# EAGLE design Modulator and Front End (EAGLE 5.11)

## Sheet 1 of 3
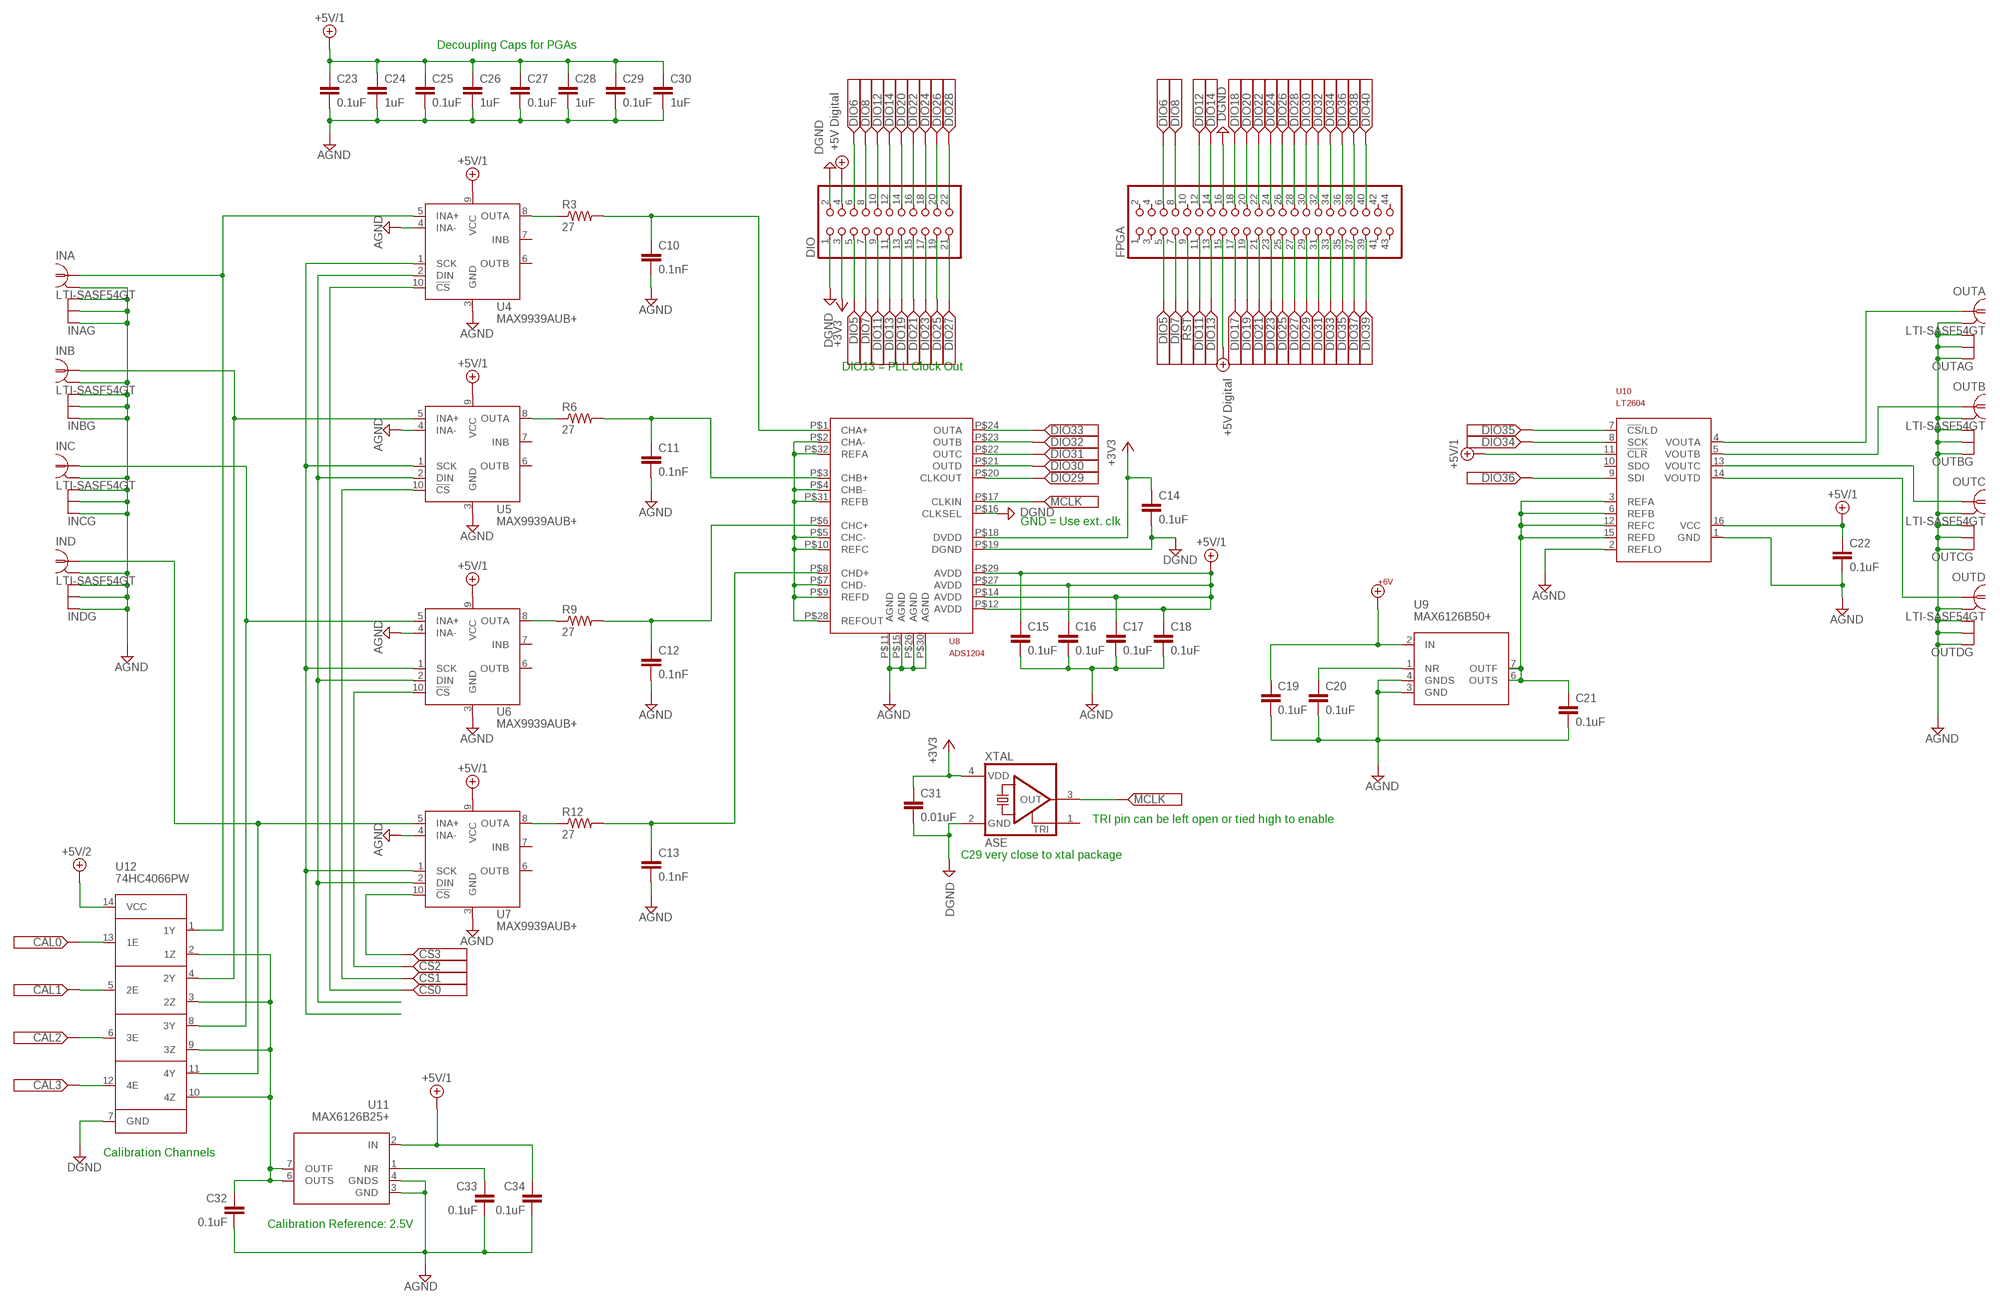
[diagram p0: schematic, sheet 1]

### Parts
C10  0.1nF  C-EUC0805  [C0805]
C11  0.1nF  C-EUC0805  [C0805]
C12  0.1nF  C-EUC0805  [C0805]
C13  0.1nF  C-EUC0805  [C0805]
C14  0.1uF  C-EUC0805  [C0805]
C15  0.1uF  C-EUC0805  [C0805]
C16  0.1uF  C-EUC0805  [C0805]
C17  0.1uF  C-EUC0805  [C0805]
C18  0.1uF  C-EUC0805  [C0805]
C19  0.1uF  C-EUC0805  [C0805]
C20  0.1uF  C-EUC0805  [C0805]
C21  0.1uF  C-EUC0805  [C0805]
C22  0.1uF  C-EUC0805  [C0805]
C23  0.1uF  C-EUC0805  [C0805]
C24  1uF  C-EUC0805  [C0805]
C25  0.1uF  C-EUC0805  [C0805]
C26  1uF  C-EUC0805  [C0805]
C27  0.1uF  C-EUC0805  [C0805]
C28  1uF  C-EUC0805  [C0805]
C29  0.1uF  C-EUC0805  [C0805]
C30  1uF  C-EUC0805  [C0805]
C31  0.01uF  C-EUC0805  [C0805]
C32  0.1uF  C-EUC0805  [C0805]
C33  0.1uF  C-EUC0805  [C0805]
C34  0.1uF  C-EUC0805  [C0805]
DIO  PINHD-2X11  [2X11]
FPGA  PINHD-2X22  [2X22]
INA  LTI-SASF54GT  [LTI-SASF54GT]
INB  LTI-SASF54GT  [LTI-SASF54GT]
INC  LTI-SASF54GT  [LTI-SASF54GT]
IND  LTI-SASF54GT  [LTI-SASF54GT]
OUTA  LTI-SASF54GT  [LTI-SASF54GT]
OUTB  LTI-SASF54GT  [LTI-SASF54GT]
OUTC  LTI-SASF54GT  [LTI-SASF54GT]
OUTD  LTI-SASF54GT  [LTI-SASF54GT]
R3  27  R-US_M0805  [M0805]
R6  27  R-US_M0805  [M0805]
R9  27  R-US_M0805  [M0805]
R12  27  R-US_M0805  [M0805]
U4  MAX9939AUB+  [UMAX10]
U5  MAX9939AUB+  [UMAX10]
U6  MAX9939AUB+  [UMAX10]
U7  MAX9939AUB+  [UMAX10]
U8  ADS1204  [QFN-32]
U9  MAX6126B50+  [UMAX8]
U10  LT2604  [SSOP16]
U11  MAX6126B25+  [UMAX8]
U12  74HC4066PW  [TSSOP14]
XTAL  ASE  [ASE]

### Nets
+3V3: C14.1 C31.1 DIO.3 U8.P$18(DVDD) XTAL.4(VDD) ; also sheet 2
+5V/1: C15.1 C16.1 C17.1 C18.1 C22.1 C23.1 C24.1 C25.1 C26.1 C27.1 C28.1 C29.1 C30.1 C34.1 U4.9(VCC) U5.9(VCC) U6.9(VCC) U7.9(VCC) U8.P$12(AVDD) U8.P$14(AVDD) U8.P$27(AVDD) U8.P$29(AVDD) U10.11(!CLR) U10.16(VCC) U11.2(IN) ; also sheet 2
+5V/2: DIO.4 FPGA.15 U12.14(VCC) ; supply symbol labelled +5V Digital ; also sheet 2,3
+6V: C19.1 U9.2(IN) ; also sheet 2
AGND: C10.2 C11.2 C12.2 C13.2 C15.2 C16.2 C17.2 C18.2 C19.2 C20.2 C21.2 C22.2 C23.2 C24.2 C25.2 C26.2 C27.2 C28.2 C29.2 C30.2 C32.2 C33.2 C34.2 INA.2(GND) INA.3(GND) INA.4(GND) INA.5(GND) INB.2(GND) INB.3(GND) INB.4(GND) INB.5(GND) INC.2(GND) INC.3(GND) INC.4(GND) INC.5(GND) IND.2(GND) IND.3(GND) IND.4(GND) IND.5(GND) OUTA.2(GND) OUTA.3(GND) OUTA.4(GND) OUTA.5(GND) OUTB.2(GND) OUTB.3(GND) OUTB.4(GND) OUTB.5(GND) OUTC.2(GND) OUTC.3(GND) OUTC.4(GND) OUTC.5(GND) OUTD.2(GND) OUTD.3(GND) OUTD.4(GND) OUTD.5(GND) U4.3(GND) U4.4(INA-) U5.3(GND) U5.4(INA-) U6.3(GND) U6.4(INA-) U7.3(GND) U7.4(INA-) U8.P$11(AGND) U8.P$15(AGND) U8.P$26(AGND) U8.P$30(AGND) U9.3(GND) U9.4(GNDS) U10.1(GND) U10.2(REFLO) U11.3(GND) U11.4(GNDS) ; also sheet 2
CAL0: U12.13(1E) ; also sheet 3
CAL1: U12.5(2E) ; also sheet 3
CAL2: U12.6(3E) ; also sheet 3
CAL3: U12.12(4E) ; also sheet 3
CS0: U4.10(!CS) ; also sheet 3
CS1: U5.10(!CS) ; also sheet 3
CS2: U6.10(!CS) ; also sheet 3
CS3: U7.10(!CS) ; also sheet 3
DGND: C14.2 C31.2 DIO.1 DIO.2 FPGA.16 U8.P$16(CLKSEL) U8.P$19(DGND) U12.7(GND) XTAL.2(GND) ; also sheet 2,3
DIO5: DIO.5 FPGA.5
DIO6: DIO.6 FPGA.6
DIO7: DIO.7 FPGA.7
DIO8: DIO.8 FPGA.8
DIO11: DIO.9 FPGA.11
DIO12: DIO.10 FPGA.12
DIO13: DIO.11 FPGA.13
DIO14: DIO.12 FPGA.14
DIO17: FPGA.17
DIO18: FPGA.18
DIO19: DIO.13 FPGA.19
DIO20: DIO.14 FPGA.20
DIO21: DIO.15 FPGA.21
DIO22: DIO.16 FPGA.22
DIO23: DIO.17 FPGA.23
DIO24: DIO.18 FPGA.24
DIO25: DIO.19 FPGA.25
DIO26: DIO.20 FPGA.26
DIO27: DIO.21 FPGA.27
DIO28: DIO.22 FPGA.28
DIO29: FPGA.29 U8.P$20(CLKOUT)
DIO30: FPGA.30 U8.P$21(OUTD)
DIO31: FPGA.31 U8.P$22(OUTC)
DIO32: FPGA.32 U8.P$23(OUTB)
DIO33: FPGA.33 U8.P$24(OUTA)
DIO34: FPGA.34 U10.8(SCK) ; also sheet 3
DIO35: FPGA.35 U10.7(!CS!/LD)
DIO36: FPGA.36 U10.9(SDI) ; also sheet 3
DIO37: FPGA.37
DIO38: FPGA.38
DIO39: FPGA.39
DIO40: FPGA.40
MCLK: U8.P$17(CLKIN) XTAL.3(OUT)
N$1: R12.1 U7.8(OUTA)
N$3: R9.1 U6.8(OUTA)
N$4: C10.1 R3.2 U8.P$1(CHA+)
N$6: R6.1 U5.8(OUTA)
N$10: R3.1 U4.8(OUTA)
N$11: C32.1 U11.6(OUTS) U11.7(OUTF) U12.2(1Z) U12.3(2Z) U12.9(3Z) U12.10(4Z)
N$12: C33.1 U11.1(NR)
N$14: C11.1 R6.2 U8.P$3(CHB+)
N$15: INA.1 U4.5(INA+) U12.1(1Y)
N$17: INB.1 U5.5(INA+) U12.4(2Y)
N$18: INC.1 U6.5(INA+) U12.8(3Y)
N$20: C12.1 R9.2 U8.P$6(CHC+)
N$21: C13.1 R12.2 U8.P$8(CHD+)
N$25: IND.1 U7.5(INA+) U12.11(4Y)
N$26: C20.1 U9.1(NR)
N$30: C21.1 U9.6(OUTS) U9.7(OUTF) U10.3(REFA) U10.6(REFB) U10.12(REFC) U10.15(REFD)
N$32: OUTA.1 U10.4(VOUTA)
N$33: OUTB.1 U10.5(VOUTB)
N$34: OUTC.1 U10.13(VOUTC)
N$35: OUTD.1 U10.14(VOUTD)
PDAT: U4.2(DIN) U5.2(DIN) U6.2(DIN) U7.2(DIN)
PLAT: U4.1(SCK) U5.1(SCK) U6.1(SCK) U7.1(SCK)
RST: FPGA.9
VREF: U8.P$2(CHA-) U8.P$4(CHB-) U8.P$5(CHC-) U8.P$7(CHD-) U8.P$9(REFD) U8.P$10(REFC) U8.P$28(REFOUT) U8.P$31(REFB) U8.P$32(REFA)
Unconnected: FPGA.1 FPGA.2 FPGA.3 FPGA.4 FPGA.10 FPGA.41 FPGA.42 FPGA.43 FPGA.44 U4.6(OUTB) U4.7(INB) U5.6(OUTB) U5.7(INB) U6.6(OUTB) U6.7(INB) U7.6(OUTB) U7.7(INB) U10.10(SDO) XTAL.1(TRI)

### Notes on the sheet
- Decoupling Caps for PGAs
- DIO13 = PLL Clock Out
- GND = Use ext. clk
- TRI pin can be left open or tied high to enable
- C29 very close to xtal package
- Calibration Channels
- Calibration Reference: 2.5V

## Sheet 2 of 3
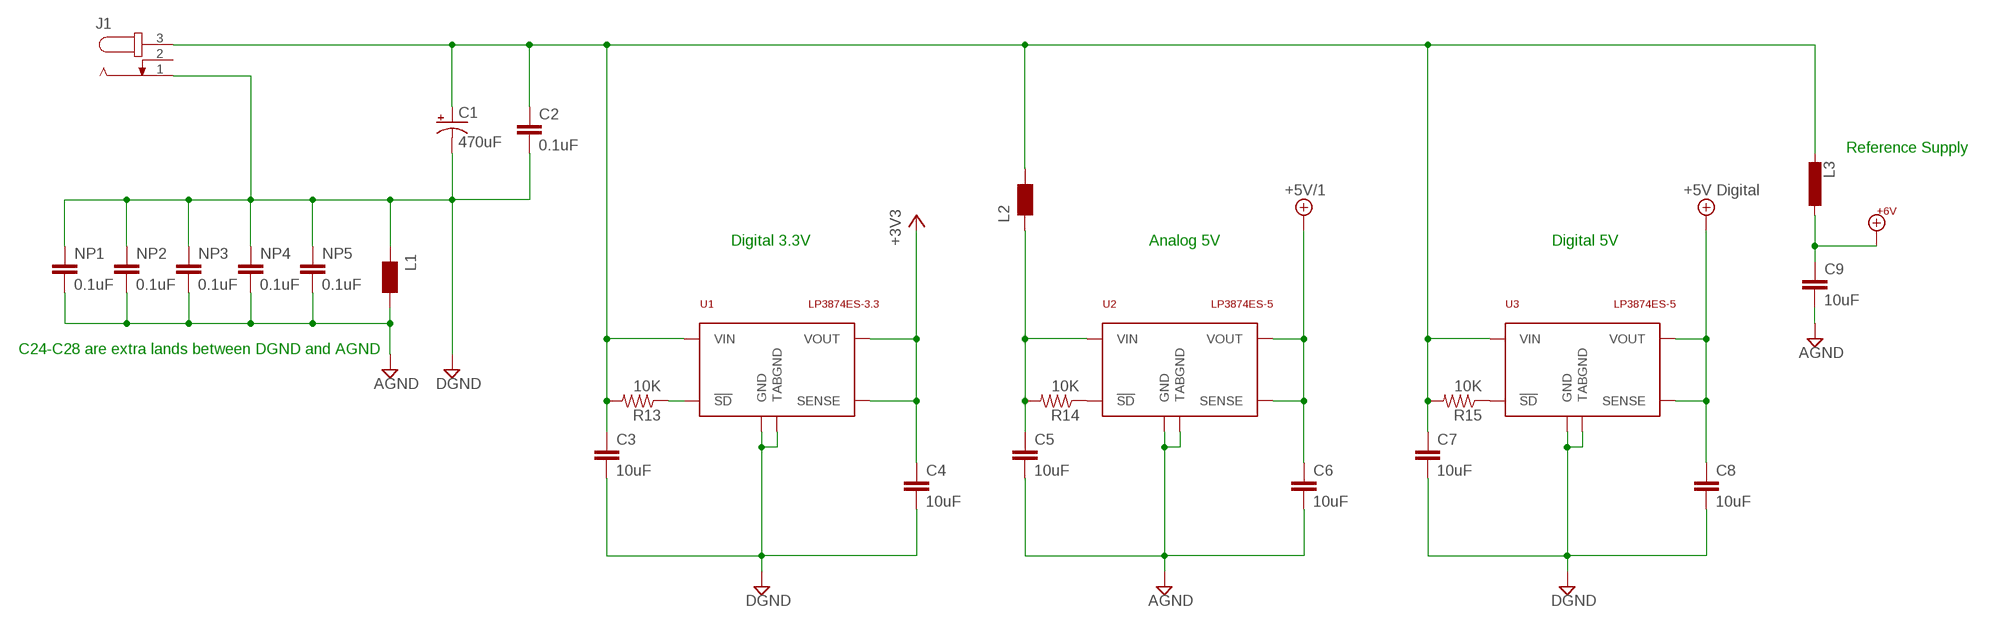
[diagram p1: schematic, sheet 2]

### Parts
C1  470uF  CPOL-USE5-13  [E5-13]
C2  0.1uF  C-EUC0805  [C0805]
C3  10uF  C-EUC1206  [C1206]
C4  10uF  C-EUC1206  [C1206]
C5  10uF  C-EUC1206  [C1206]
C6  10uF  C-EUC1206  [C1206]
C7  10uF  C-EUC1206  [C1206]
C8  10uF  C-EUC1206  [C1206]
C9  10uF  C-EUC1206  [C1206]
J1  JACK-PLUG1  [SPC4078]
L1  WE-CBF_0603  [0603]
L2  WE-CBF_0603  [0603]
L3  L-EUL1812  [L1812]
NP1  0.1uF  C-EUC0805  [C0805]
NP2  0.1uF  C-EUC0805  [C0805]
NP3  0.1uF  C-EUC0805  [C0805]
NP4  0.1uF  C-EUC0805  [C0805]
NP5  0.1uF  C-EUC0805  [C0805]
R13  10K  R-US_M0805  [M0805]
R14  10K  R-US_M0805  [M0805]
R15  10K  R-US_M0805  [M0805]
U1  LP3874ES-3.3  [TO263-5]
U2  LP3874ES-5  [TO263-5]
U3  LP3874ES-5  [TO263-5]

### Nets
+3V3: C4.1 U1.4(VOUT) U1.5(SENSE) ; also sheet 1
+5V/1: C6.1 U2.4(VOUT) U2.5(SENSE) ; also sheet 1
+5V/2: C8.1 U3.4(VOUT) U3.5(SENSE) ; supply symbol labelled +5V Digital ; also sheet 1,3
+6V: C9.1 L3.1 ; also sheet 1
AGND: C5.2 C6.2 C9.2 L1.2 NP1.2 NP2.2 NP3.2 NP4.2 NP5.2 U2.3(GND) U2.6(TABGND) ; also sheet 1
DGND: C1.- C2.2 C3.2 C4.2 C7.2 C8.2 J1.1 L1.1 NP1.1 NP2.1 NP3.1 NP4.1 NP5.1 U1.3(GND) U1.6(TABGND) U3.3(GND) U3.6(TABGND) ; also sheet 1,3
N$7: R14.1 U2.1(!SD)
N$8: C5.1 L2.1 R14.2 U2.2(VIN)
N$9: R13.1 U1.1(!SD)
N$31: R15.1 U3.1(!SD)
PWRIN: C1.+ C2.1 C3.1 C7.1 J1.3 L2.2 L3.2 R13.2 R15.2 U1.2(VIN) U3.2(VIN)
Unconnected: J1.2

### Notes on the sheet
- Reference Supply
- Digital 3.3V | Analog 5V | Digital 5V
- C24-C28 are extra lands between DGND and AGND

## Sheet 3 of 3
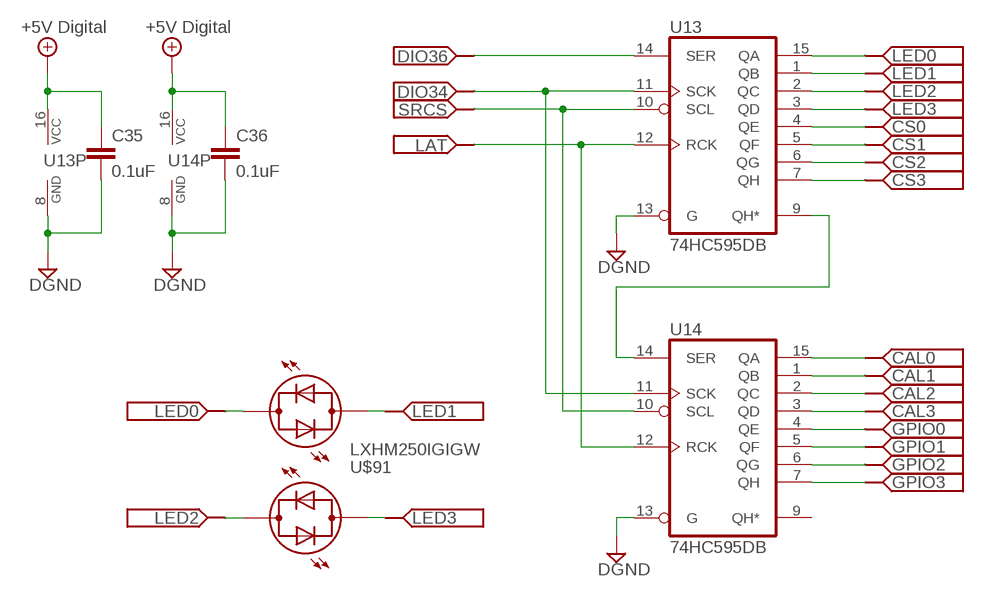
[diagram p2: schematic, sheet 3]

### Parts
C35  0.1uF  C-EUC0805  [C0805]
C36  0.1uF  C-EUC0805  [C0805]
U13  74HC595DB  [SSOP16]
U14  74HC595DB  [SSOP16]
U$91  LXHM250IGIGW  [LXHM250IGIGW]

### Nets
+5V/2: C35.1 C36.1 U13.16(VCC) U14.16(VCC) ; supply symbol labelled +5V Digital ; also sheet 1,2
CAL0: U14.15(QA) ; also sheet 1
CAL1: U14.1(QB) ; also sheet 1
CAL2: U14.2(QC) ; also sheet 1
CAL3: U14.3(QD) ; also sheet 1
CS0: U13.4(QE) ; also sheet 1
CS1: U13.5(QF) ; also sheet 1
CS2: U13.6(QG) ; also sheet 1
CS3: U13.7(QH) ; also sheet 1
DGND: C35.2 C36.2 U13.8(GND) U13.13(G) U14.8(GND) U14.13(G) ; also sheet 1,2
DIO34: U13.11(SCK) U14.11(SCK) ; also sheet 1
DIO36: U13.14(SER) ; also sheet 1
GPIO0: U14.4(QE)
GPIO1: U14.5(QF)
GPIO2: U14.6(QG)
GPIO3: U14.7(QH)
LAT: U13.12(RCK) U14.12(RCK)
LED0: U13.15(QA) U$91.AR1
LED1: U13.1(QB) U$91.AG1
LED2: U13.2(QC) U$91.AR2
LED3: U13.3(QD) U$91.AG2
N$2: U13.9(QH*) U14.14(SER)
SRCS: U13.10(SCL) U14.10(SCL)
Unconnected: U14.9(QH*)

## Library data of the parts
C1 = rcl:CPOL-US: POLARIZED CAPACITOR, American symbol
C2-C36 NP1-NP5 = rcl:C-EU: CAPACITOR, European symbol
DIO = pinhead:PINHD-2X11: PIN HEADER
FPGA = pinhead:PINHD-2X22: PIN HEADER
INA INB INC IND OUTA OUTB OUTC OUTD = con-coax:LTI-SASF54GT: SMA vertical PCB thrue hole jack Source: Lighthorse Technologies, inc. SASF54GT.pdf; OC_FARNELL: unknown; OC_NEWARK: unknown
J1 = con-jack:JACK-PLUG: DC POWER JACK Power Jack, DC, Right Angle, Through Hole, Rated 5A at 16VDC, PC Terminals Distributor: Farnell (www.Farnell.de) Drawing: 84N1161.pdf / 84N1162.pdf Manufacturer: SPC Technology (www.spctechnology.com) Type: SPC4077 / SPC 4078; OC_FARNELL: unknown; OC_NEWARK: unknown
L1 L2 = wuerth-elektronik:WE-CBF: SMD EMI Suppression Ferrite Beads - excellent anti-EMI properties - low DCR - impedances till 3000 ohms - rated current up to 6 A
L3 = rcl:L-EU: INDUCTOR, European symbol
R3 R6 R9 R12-R15 = rcl:R-US_: RESISTOR, American symbol
U1-U3 = national-semiconductor:LP3874
U4-U7 = maxim:MAX9939: SPI Programmable-Gain Amplifier with Input Vos Trim and Output Op Amp The MAX9939 is a SPI programmable single PGA amplifier. Gains range from 0.25V/V to 157V/V and it contains an input offset trimming register and offset test capability. It also includes a separate op amp with accessible inverting input and output for an external filter or for adding differential output. The non-inverting input of the secondary op amp is tied to Vcc/2.
U8 = texas:ADS1204: Four 1-Bit, 10MHz, 2nd-Order DELTA-SIGMA MODULATORS Source: http://focus.ti.com/docs/prod/folders/print/ads1204.html
U9 U11 = maxim:MAX6126: Ultra-High-Precision, Ultra-Low-Noise, Series Voltage Reference
U10 = linear-technology:LT2604
U12 = 74xx-us:74*4066
U13 U14 = 74xx-eu:74*595: 8-bit SHIFT REGISTER, output latch
U$91 = led:LXHM250IGIGW
XTAL = crystal:ASE: 3.3Vdc CMOS SMD CRYSTAL CLOCK OSCILLATOR SOurce: www.abracon.com; OC_FARNELL: unknown; OC_NEWARK: unknown

## Board
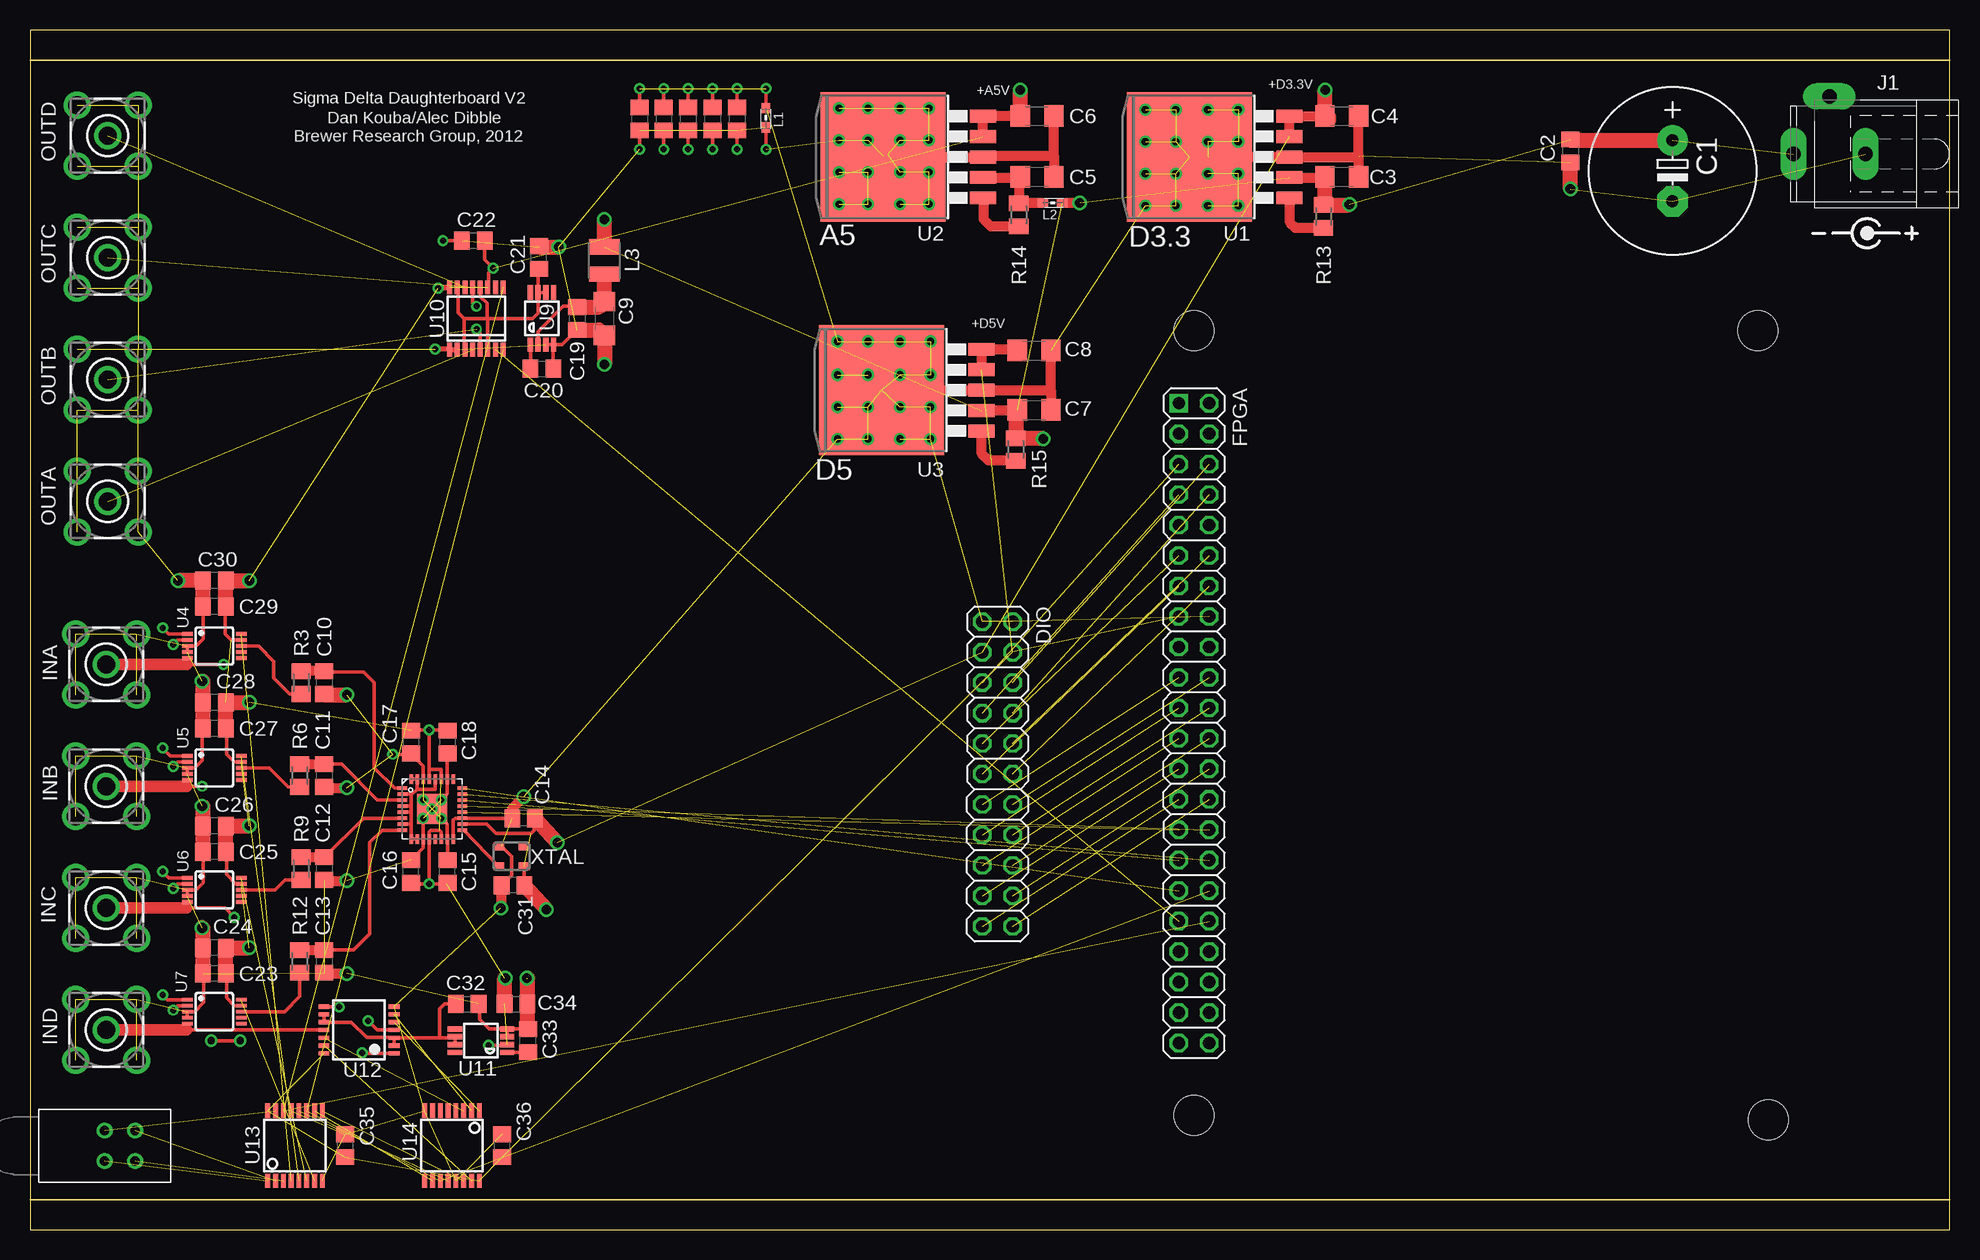
[diagram p3: board, top side]
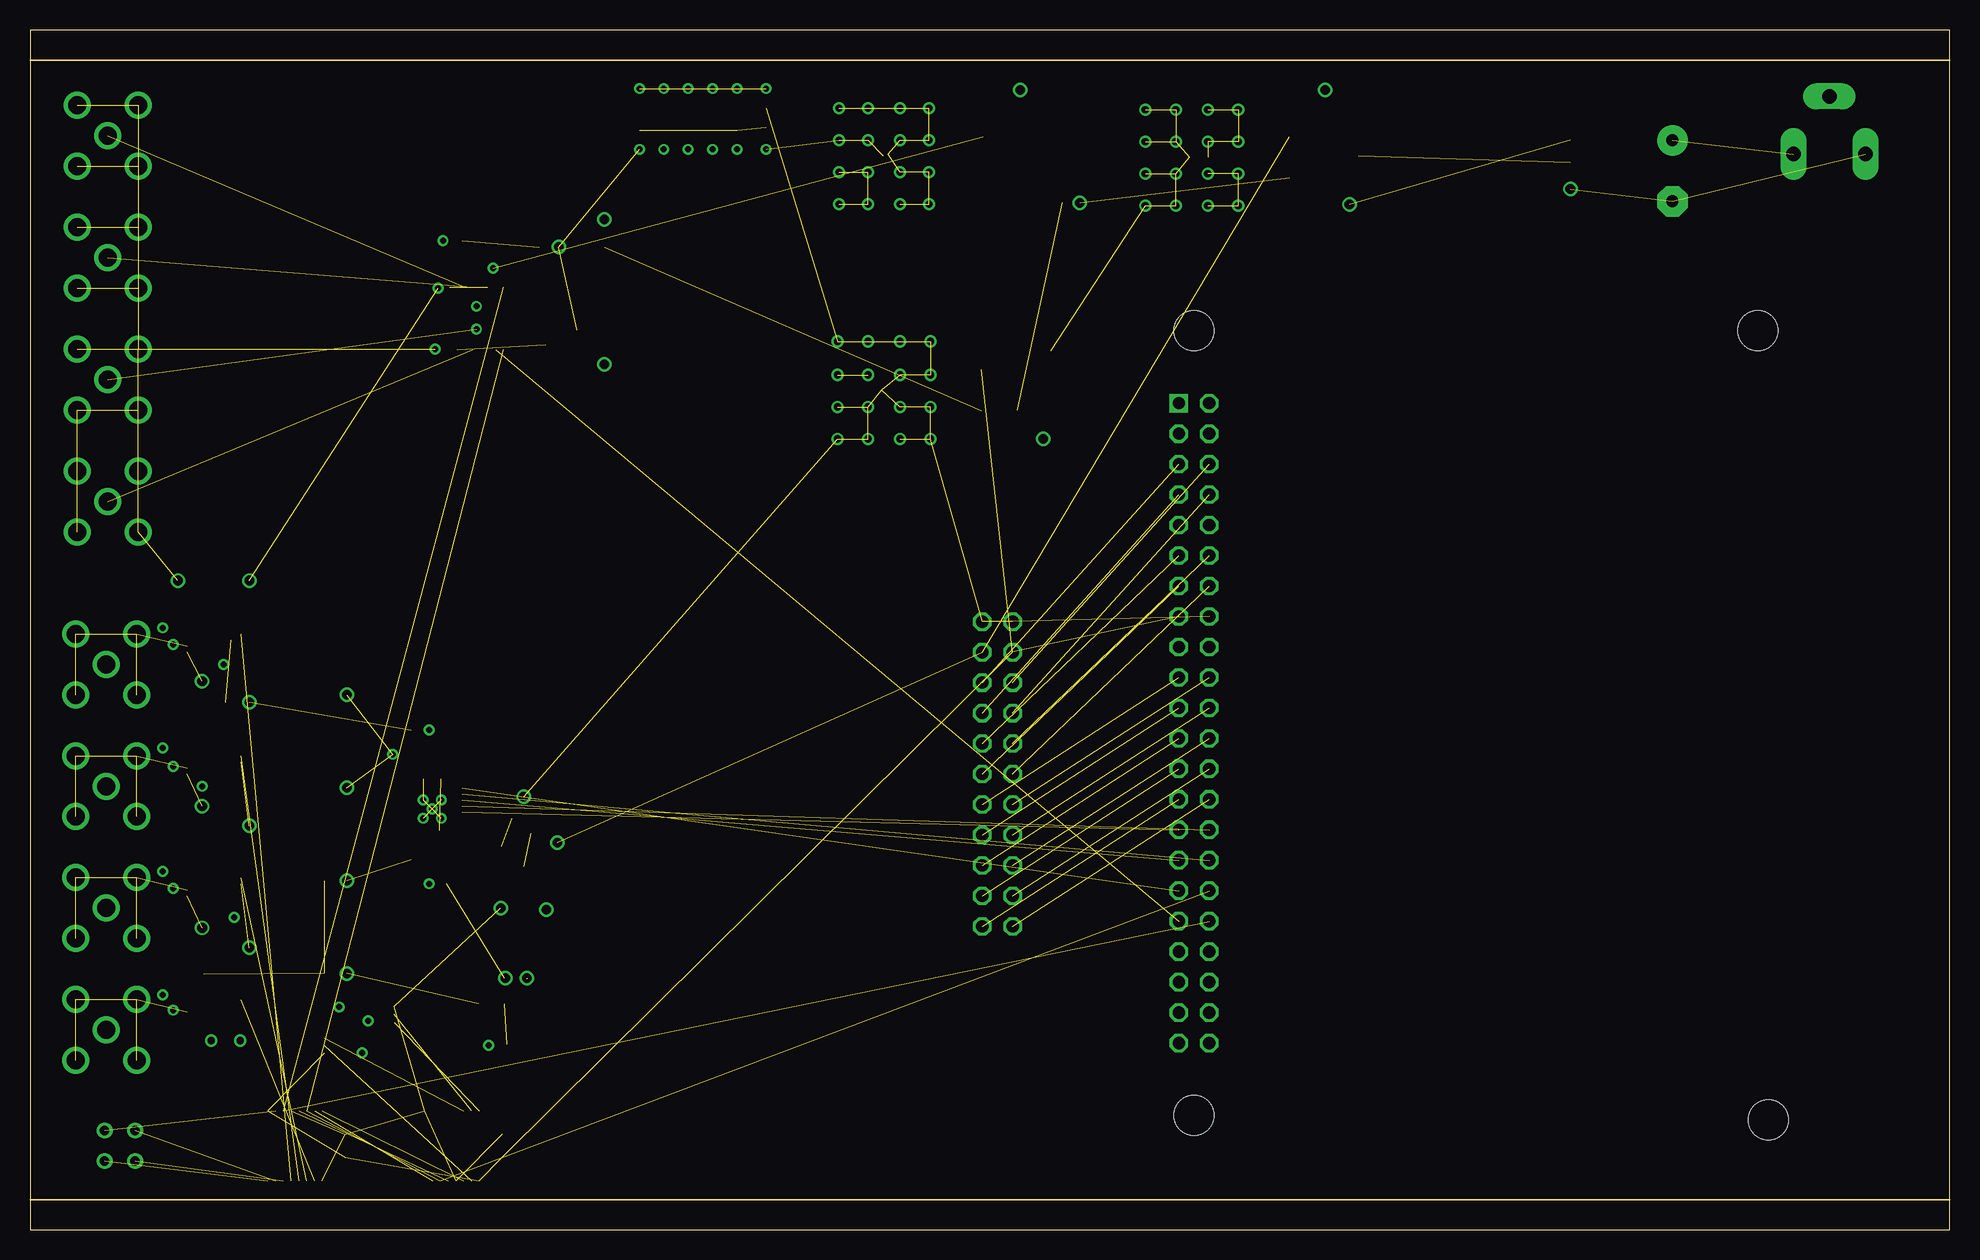
[diagram p4: board, inner layer Route3]
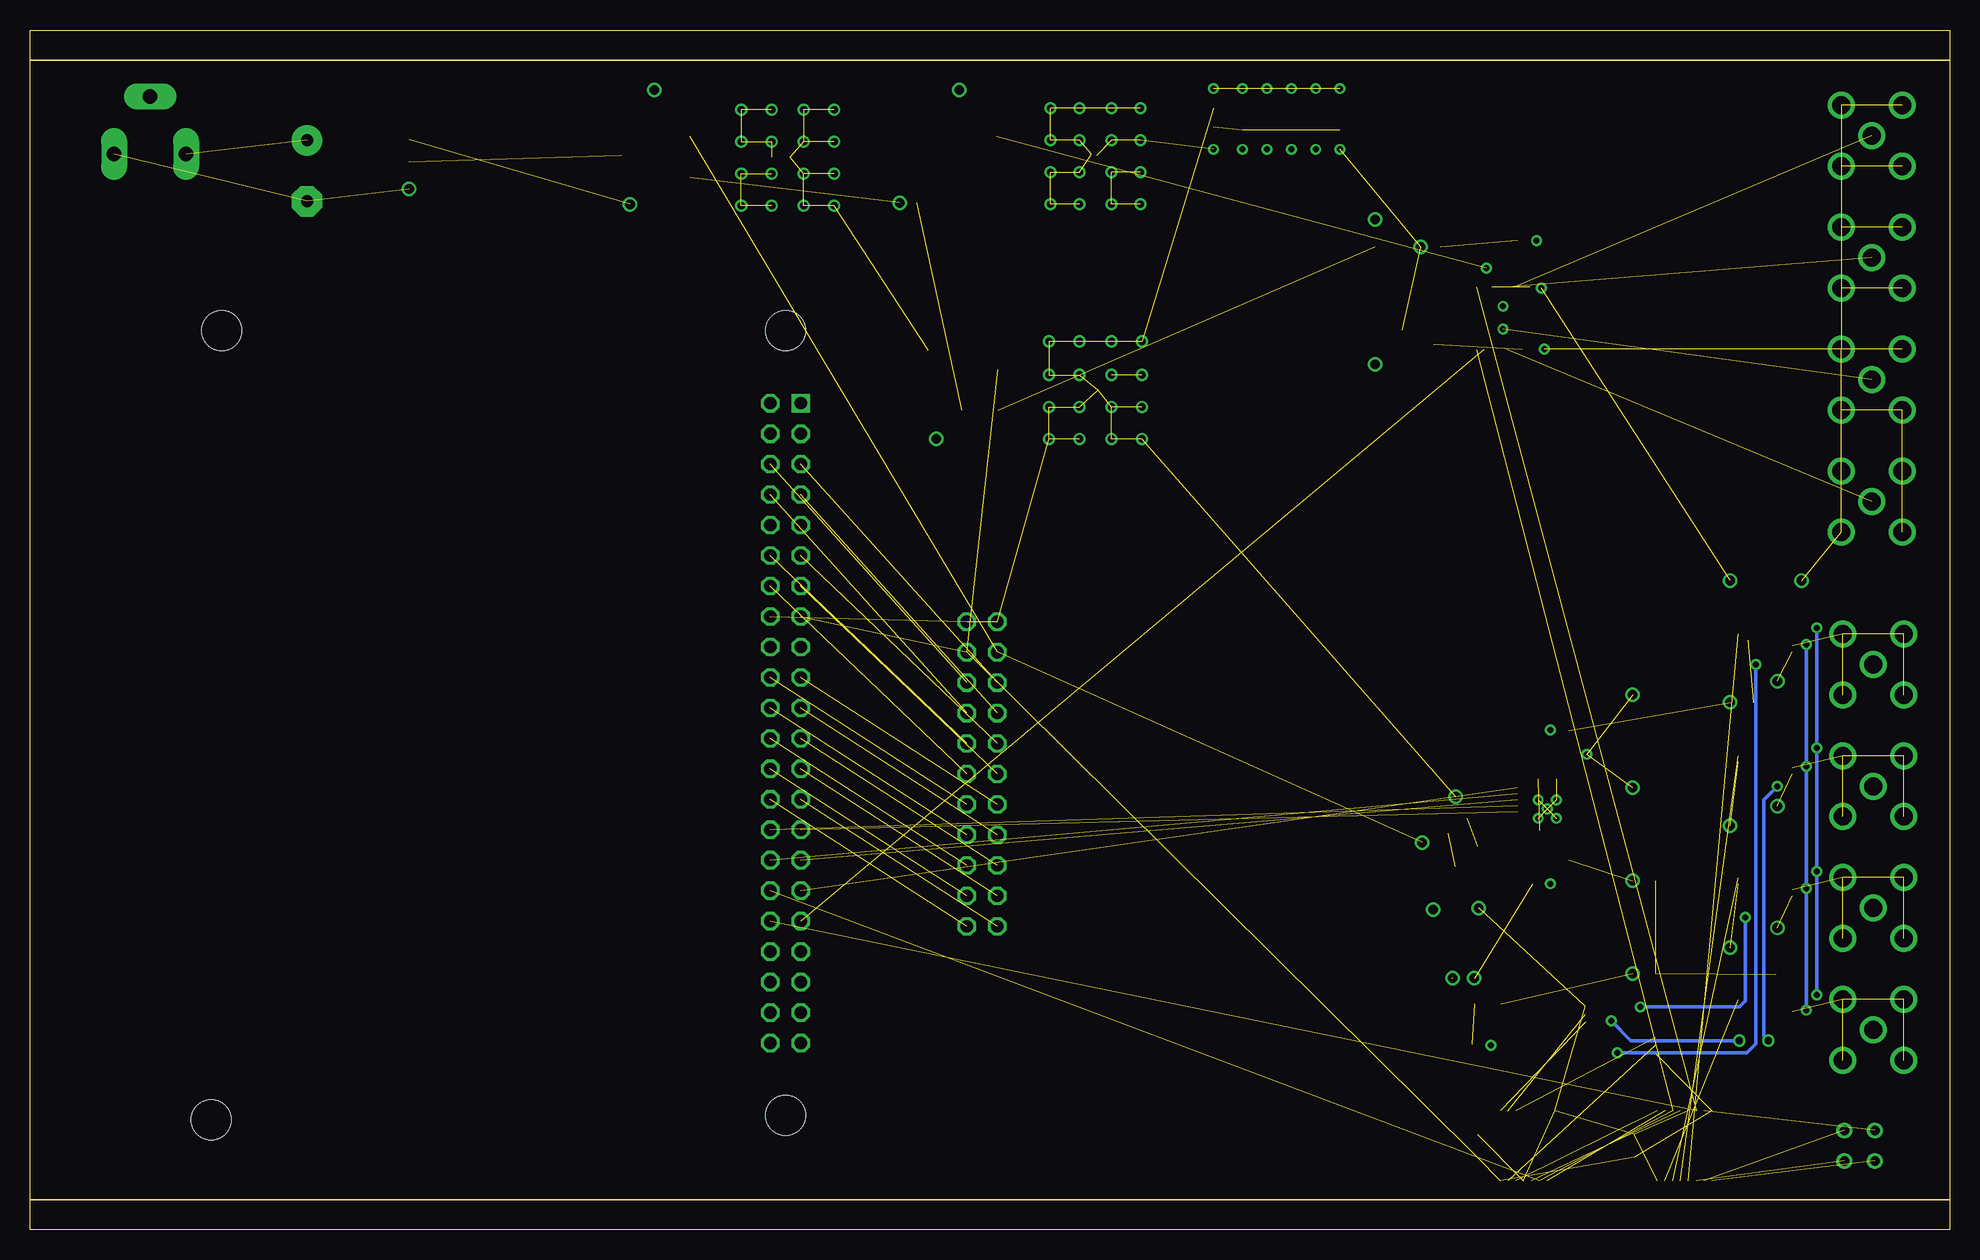
[diagram p5: board, bottom side, seen from below]

Size 160 x 100 mm. Coordinates in mm from the lower left corner, seen from the top.
Outline: 160,2.5 160,0 0,0 0,2.5
Outline: 160,2.5 160,97.5
Outline: 160,97.5 160,100 0,100 0,97.5
Outline: 0,97.5 0,2.5
Outline: 0,2.5 160,2.5
Outline: 0,97.5 160,97.5
Copper layers (1*2+3*16): Top 0.035mm / dielectric 1.5mm / Route2 0.035mm / dielectric 0.15mm / Route3 0.035mm / dielectric 0.2mm / Bottom 0.035mm
Design rules "default *": minimum track width 10mil, minimum drill 24mil, track to track 8mil, track to pad 8mil, pad to pad 8mil, via to via 8mil, smd to smd 8mil, copper to edge 40mil, drill to drill 8mil, minimum pad ring 10mil, minimum via ring 8mil, stop-mask expansion 4mil, vias tented up to drill 0mil, thermal gap 10mil
Holes 3.3 mm at 97.03,74.93 97.03,9.53 144.02,74.93 144.91,9.14
tKeepout: area 93.9,71.8 to 100.2,78.1; area 93.9,6.4 to 100.2,12.7; area 140.8,71.8 to 147.2,78.1; area 141.7,6 to 148.1,12.3

### Footprints (pad centres in the part's own frame; a part is rotated, then mirrored left to right if it is on the bottom)
E5-13 = drill 1.016 pad 2.54 round: + -2.54,0 | drill 1.016 pad 2.54 octagon: - 2.54,0
C0805 = smd 1.3 x 1.5: 1 -0.95,0; 2 0.95,0
C1206 = smd 1.6 x 1.8: 1 -1.4,0; 2 1.4,0
2X11 = drill 1.016 octagon: 1 -12.7,-1.27; 2 -12.7,1.27; 3 -10.16,-1.27; 4 -10.16,1.27; 5 -7.62,-1.27; 6 -7.62,1.27; 7 -5.08,-1.27; 8 -5.08,1.27; 9 -2.54,-1.27; 10 -2.54,1.27; 11 0,-1.27; 12 0,1.27; 13 2.54,-1.27; 14 2.54,1.27; 15 5.08,-1.27; 16 5.08,1.27; 17 7.62,-1.27; 18 7.62,1.27; 19 10.16,-1.27; 20 10.16,1.27; 21 12.7,-1.27; 22 12.7,1.27
2X22@1 = drill 1.016 square: 1 0,0 | drill 1.016 octagon: 2 0,2.54; 3 2.54,0; 4 2.54,2.54; 5 5.08,0; 6 5.08,2.54; 7 7.62,0; 8 7.62,2.54; 9 10.16,0; 10 10.16,2.54; 11 12.7,0; 12 12.7,2.54; 13 15.24,0; 14 15.24,2.54; 15 17.78,0; 16 17.78,2.54; 17 20.32,0; 18 20.32,2.54; 19 22.86,0; 20 22.86,2.54; 21 25.4,0; 22 25.4,2.54; 23 27.94,0; 24 27.94,2.54; 25 30.48,0; 26 30.48,2.54; 27 33.02,0; 28 33.02,2.54; 29 35.56,0; 30 35.56,2.54; 31 38.1,0; 32 38.1,2.54; 33 40.64,0; 34 40.64,2.54; 35 43.18,0; 36 43.18,2.54; 37 45.72,0; 38 45.72,2.54; 39 48.26,0; 40 48.26,2.54; 41 50.8,0; 42 50.8,2.54; 43 53.34,0; 44 53.34,2.54
LTI-SASF54GT = drill 1.5 pad 2.2 round: 1 0,0; 2 -2.54,2.54; 3 2.54,2.54; 4 2.54,-2.54; 5 -2.54,-2.54
SPC4078 = drill 1.2 pad 2.184 long: 1 -3,0; 2 0,-4.8; 3 3,0
0603 = smd 0.85 x 0.7: 1 -0.9,0; 2 0.7,0
L1008 = smd 1.27 x 2.54: 1 -1.135,0; 2 1.135,0
M0805 = smd 1.3 x 1.6: 1 -0.95,0; 2 0.95,0
TO263-5 = smd 1.067 x 2.159: 1 -3.404,-5.791; 2 -1.702,-5.791; 3 0,-5.791; 4 1.702,-5.791; 5 3.404,-5.791 | smd 10.8 x 10.41: 6 0,2.54
UMAX10 = smd 0.32 x 0.9: 1 -1,-2.25; 2 -0.5,-2.25; 3 0,-2.25; 4 0.5,-2.25; 5 1,-2.25; 6 1,2.25; 7 0.5,2.25; 8 0,2.25; 9 -0.5,2.25; 10 -1,2.25
QFN-32 = smd 0.285 x 0.8: P$1 -1.75,-2.5; P$2 -1.25,-2.5; P$3 -0.75,-2.5; P$4 -0.25,-2.5; P$5 0.25,-2.5; P$6 0.75,-2.5; P$7 1.25,-2.5; P$8 1.75,-2.5; P$17 1.75,2.5; P$18 1.25,2.5; P$19 0.75,2.5; P$20 0.25,2.5; P$21 -0.25,2.5; P$22 -0.75,2.5; P$23 -1.25,2.5; P$24 -1.75,2.5 | smd 0.8 x 0.285: P$9 2.5,-1.75; P$10 2.5,-1.25; P$11 2.5,-0.75; P$12 2.5,-0.25; P$13 2.5,0.25; P$14 2.5,0.75; P$15 2.5,1.25; P$16 2.5,1.75; P$25 -2.5,1.75; P$26 -2.5,1.25; P$27 -2.5,0.75; P$28 -2.5,0.25; P$29 -2.5,-0.25; P$30 -2.5,-0.75; P$31 -2.5,-1.25; P$32 -2.5,-1.75 | smd 2.5 x 2.5: P$33 0,0
UMAX8 = smd 0.45 x 1.2: 1 -0.975,-2.175; 2 -0.325,-2.175; 3 0.325,-2.175; 4 0.975,-2.175; 5 0.975,2.175; 6 0.325,2.175; 7 -0.325,2.175; 8 -0.975,2.175
SSOP16 = smd 0.419 x 1.143: 1 -2.223,-2.6; 2 -1.587,-2.6; 3 -0.953,-2.6; 4 -0.318,-2.6; 5 0.318,-2.6; 6 0.953,-2.6; 7 1.587,-2.6; 8 2.223,-2.6; 9 2.223,2.6; 10 1.587,2.6; 11 0.953,2.6; 12 0.318,2.6; 13 -0.318,2.6; 14 -0.953,2.6; 15 -1.587,2.6; 16 -2.223,2.6
TSSOP14 = smd 0.35 x 0.9: 1 -1.95,-2.925; 2 -1.3,-2.925; 3 -0.65,-2.925; 4 0,-2.925; 5 0.65,-2.925; 6 1.3,-2.925; 7 1.95,-2.925; 8 1.95,2.925; 9 1.3,2.925; 10 0.65,2.925; 11 0,2.925; 12 -0.65,2.925; 13 -1.3,2.925; 14 -1.95,2.925
SSOP16' = smd 0.4 x 1.2: 1 -2.275,-2.925; 2 -1.625,-2.925; 3 -0.975,-2.925; 4 -0.325,-2.925; 5 0.325,-2.925; 6 0.975,-2.925; 7 1.625,-2.925; 8 2.275,-2.925; 9 2.275,2.925; 10 1.625,2.925; 11 0.975,2.925; 12 0.325,2.925; 13 -0.325,2.925; 14 -0.975,2.925; 15 -1.625,2.925; 16 -2.275,2.925
LXHM250IGIGW = drill 0.8 round: AG1 -1.27,0; AG2 -1.27,-2.54; AR1 1.27,0; AR2 1.27,-2.54
ASE = smd 0.9 x 0.65: 1 -1.05,-0.825; 2 1.05,-0.825; 3 1.05,0.825; 4 -1.05,0.825

### Placement (x,y rotation side)
C1  136.91,88.27 270 top
C2  128.4,89.92 270 top
C3  109.35,87.76 0 top
C4  109.35,92.84 0 top
C5  83.95,87.76 0 top
C6  83.95,92.84 0 top
C7  83.69,68.33 0 top
C8  83.69,73.28 0 top
C9  47.88,75.95 270 top
C10  24.51,45.59 270 top
C11  24.51,37.85 270 top
C12  24.51,30.1 270 top
C13  24.51,22.35 270 top
C14  41.15,34.29 180 top
C15  34.8,29.84 90 top
C16  31.75,29.84 90 top
C17  31.75,40.64 270 top
C18  34.8,40.64 270 top
C19  45.59,75.95 270 top
C20  42.67,71.75 0 top
C21  42.42,81.03 90 top
C22  36.96,82.42 180 top
C23  15.37,21.34 180 top
C24  15.37,23.5 180 top
C25  15.37,31.5 180 top
C26  15.37,33.66 180 top
C27  15.37,41.78 180 top
C28  15.37,43.94 180 top
C29  15.37,51.94 180 top
C30  15.37,54.1 180 top
C31  40.26,28.7 180 top
C32  36.45,18.8 0 top
C33  41.53,15.75 90 top
C34  40.51,18.8 0 top
C35  26.29,6.99 90 top
C36  39.37,6.99 90 top
DIO  80.64,37.97 270 top
FPGA  [2X22@1]  95.76,68.88 270 top
INA  6.35,47.12 90 top
INB  6.35,36.96 90 top
INC  6.35,26.8 90 top
IND  6.35,16.64 90 top
J1  149.99,89.66 180 top
L1  61.34,92.58 270 top
L2  85.34,85.6 0 top
L3  [L1008]  47.88,80.77 90 top
NP1  58.93,92.58 270 top
NP2  56.9,92.58 270 top
NP3  54.86,92.58 270 top
NP4  52.83,92.58 270 top
NP5  50.8,92.58 270 top
OUTA  6.48,60.71 90 top
OUTB  6.48,70.87 90 top
OUTC  6.48,81.03 90 top
OUTD  6.48,91.19 90 top
R3  22.61,45.59 90 top
R6  22.48,37.85 90 top
R9  22.61,30.1 90 top
R12  22.48,22.35 90 top
R13  107.82,84.45 90 top
R14  82.42,84.58 90 top
R15  82.17,65.02 90 top
U1  99.19,89.41 90 top
U2  73.66,89.41 90 top
U3  73.53,69.98 90 top
U4  15.37,48.64 270 top
U5  15.37,38.48 270 top
U6  15.37,28.32 270 top
U7  15.37,18.16 270 top
U8  33.53,35.05 270 top
U9  42.67,75.95 0 top
U10  37.21,75.95 0 top
U11  37.59,15.75 90 top
U12  27.43,16.64 90 top
U13  74HC595DB  [SSOP16']  22.1,6.99 0 top
U14  74HC595DB  [SSOP16']  35.18,6.99 180 top
U$91  6.22,6.99 90 top
XTAL  40.13,31.11 180 top

### Tracks (layer width: path | path; a pad name or v marks a point on that pad's centre or on a via)
+3V3  (via drill 0.8)  (3 unrouted)
  Top 0.305: U8.P$18 38.08,33.8 38.86,33.02 41.78,33.02 42.04,33.27 42.04,34.23 C14.1 | XTAL.4 41.18,28.73 C31.1
  Top 0.813: 107.89,92.81 C4.1 107.95,92.46 108.46,92.46 108.46,92.81 U1.5 U1.4
  Top 1.27: v43.05,26.67 C31.1 | C14.1 v43.94,32.26 | C4.1 v107.95,94.99 v107.95,95
+5V/1  (via drill 0.5, 0.8)  (10 unrouted)
  Top 0.305: 34.29,37.56 U8.P$27 34.28,38.34 34.29,38.35 33.28,38.35 | U8.P$29 33.28,38.35 | U8.P$12 | U8.P$14 34.28,33.16 34.16,33.27 33.4,33.27 33.27,33.15 U8.P$12 | U8.P$12 33.28,31.75 33.27,31.24 v33.27,28.83 | U10.11 38.23,78.61 38.23,79.76 v38.61,80.14 37.91,80.84 C22.1 | 33.28,38.35 33.28,41.4 v33.27,41.66 | v33.27,41.66 34.73,41.66 C18.1 | v33.27,41.66 31.82,41.66 C17.1 | v33.27,28.83 31.82,28.83 C16.1 | v33.27,28.83 34.73,28.83 C15.1 | U5.9 17.03,38.98 16.38,39.62 16.38,41.72 C27.1 | U6.9 17.15,28.82 16.38,29.59 16.38,31.43 C25.1 | U4.9 16.77,49.14 16.26,49.66 16.26,51.88 C29.1 | U7.9 17.03,18.66 16.38,19.3 16.38,21.27 C23.1 | U11.2 39.77,15.37 v38.23,15.37
  Top 0.406: v34.04,78.49 34.93,78.49 U10.16
  Top 0.813: 82.39,92.81 C6.1 79.45,92.84 U2.5 U2.4
  Top 1.27: C6.1 v82.55,94.99 v82.55,95 | C23.1 C24.1 v18.29,23.5 | C25.1 C26.1 v18.29,33.66 | C29.1 C30.1 v18.29,54.1 | C27.1 C28.1 v18.29,43.94 | C34.1 39.56,20.95 v39.62,20.95
+5V/2  (7 unrouted)
  Top 0.813: 82.19,73.38 C8.1 82.29,73.38 U3.5 U3.4
  Route3 1.27: FPGA.15 95.76,51.18
+6V
  Top 0.305: C19.1 45.53,76.96 44.45,76.96 42.35,74.86 U9.2
  Top 1.27: L3.1 C9.1 47.43,76.9 C19.1
AGND  (via drill 0.5, 0.6, 0.8)  (73 unrouted)
  Top 0.305: 32.77,37.56 U8.P$30 32.78,38.66 C17.2 31.75,39.62 v30.23,39.62 | v34.29,35.81 34.78,36.3 U8.P$26 34.78,39.42 C18.2 | v34.29,34.29 34.78,33.8 U8.P$15 34.8,32.53 C15.2 | v32.77,34.29 32.78,34.28 U8.P$11 32.78,31.82 C16.2 | v58.93,90.04 NP1.2 | v56.9,90.04 NP2.2 | v54.86,90.04 NP3.2 | v52.83,90.04 NP4.2 | v50.8,90.04 NP5.2 | v34.42,82.42 C22.2 | v61.34,90.04 L1.2 | C19.2 44.37,73.77 U9.4 | U9.3 U9.4 | C20.2 43.62,73.77 U9.4 | U11.4 41.5,16.72 C33.2 41.46,16.76 | U11.4 U11.3 | U11.4 38.27,16.72 37.47,17.53 37.47,18.73 C32.2 | U7.4 U7.3 13.72,18.16 14.48,18.92 14.48,21.27 C23.2 | C27.2 14.35,41.72 14.35,39.12 13.72,38.48 U5.3 U5.4 | U6.4 U6.3 13.84,28.32 14.42,28.89 C25.2 | U4.4 U4.3 13.84,48.64 14.42,49.22 C29.2
  Top 0.406: v33.78,73.41 34.93,73.41 U10.1 U10.2
  Top 0.813: 71.5,89.66 v69.85,88.14 71.12,89.53 U2.6 U2.3 79.45,89.53 85.35,89.53 | 85.35,89.53 C6.2 | 85.35,89.53 C5.2 | 14.42,45.72 v14.35,45.72 | 12.38,54.1 v12.32,54.1 | C13.2 24.51,21.34 v26.42,21.34 | C12.2 24.51,29.08 v26.42,29.08 | C11.2 24.51,36.83 v26.42,36.83 | C10.2 24.51,44.58
  Top 1.27: C19.2 47.43,75 C9.2 v47.88,72.14 | C21.2 42.42,81.92 v44.07,81.92 | C23.2 C24.2 14.42,25.08 v14.35,25.15 | C25.2 C26.2 14.42,35.24 v14.35,35.31 | C29.2 C30.2 12.38,54.1 | C27.2 C28.2 14.42,45.72 | 24.51,44.58 v26.42,44.58 | 41.46,20.95 C34.2 41.46,16.76
  other vias: 32.77,35.81 33.53,35.05 74.93,93.47 74.93,90.81 74.93,88.14 72.52,90.81 72.52,93.47 72.52,85.47 69.85,85.47 67.44,88.14 67.44,85.47 69.85,90.81 69.85,93.47 67.44,93.47 67.44,90.81 74.93,85.47 72.52,88.14 41.4,20.95
CAL0  (1 unrouted)
CAL1  (1 unrouted)
CAL2  (1 unrouted)
CAL3  (1 unrouted)
CS0  (1 unrouted)
CS1  (1 unrouted)
CS2  (1 unrouted)
CS3  (1 unrouted)
DGND  (via drill 0.5, 0.6, 0.8)  (52 unrouted)
  Top 0.305: NP5.1 v50.8,95.12 | NP4.1 v52.83,95.12 | NP3.1 v54.86,95.12 | NP2.1 v56.9,95.12 | U8.P$16 35.28,34.13 35.43,34.29 36.02,34.29 | 36.02,34.29 U8.P$19 | 36.02,34.29 C14.2 | XTAL.2 39.31,31.94 40.13,31.11 40.13,29.52 C31.2 | NP1.1 v58.93,95.12 | L1.1 v61.34,95.12
  Top 0.406: v98.17,88.01 98.17,89.41 | 105.03,89.41 U1.3 98.17,89.41 | 98.17,89.41 U1.6
  Top 0.813: U1.3 U1.6 | v69.85,71.25 69.85,71.12 U3.6 U3.3 85.09,69.98 | 110.75,89.53 C4.2 | 110.75,89.53 C3.2 | 105.03,89.41 110.62,89.41 110.75,89.53 | 85.09,69.98 C7.2 | C14.2 40.2,35.12 v41.15,36.07 | C31.2 39.31,26.92 v39.24,26.8 | 85.09,69.98 C8.2
  Top 1.27: v128.4,86.74 C2.2
  other vias: 100.71,85.34 98.17,85.34 95.5,85.34 92.96,85.34 92.96,88.01 95.5,88.01 100.71,88.01 100.71,90.68 98.17,90.68 95.5,90.68 92.96,90.68 92.96,93.34 95.5,93.34 98.17,93.34 100.71,93.34 75.06,65.91 72.52,65.91 69.85,65.91 67.31,65.91 75.06,68.58 75.06,71.25 75.06,74.04 72.52,68.58 69.85,68.58 67.31,68.58 72.52,71.25 72.52,74.04 67.31,71.25 69.85,74.04 67.31,74.04
DIO5  (1 unrouted)
DIO6  (1 unrouted)
DIO7  (1 unrouted)
DIO8  (1 unrouted)
DIO11  (1 unrouted)
DIO12  (1 unrouted)
DIO13  (1 unrouted)
DIO14  (1 unrouted)
DIO19  (1 unrouted)
DIO20  (1 unrouted)
DIO21  (1 unrouted)
DIO22  (1 unrouted)
DIO23  (1 unrouted)
DIO24  (1 unrouted)
DIO25  (1 unrouted)
DIO26  (1 unrouted)
DIO27  (1 unrouted)
DIO28  (1 unrouted)
DIO29  (1 unrouted)
DIO30  (1 unrouted)
DIO31  (1 unrouted)
  Bottom 0.305: FPGA.31 95.76,30.73
DIO32  (1 unrouted)
DIO33  (1 unrouted)
  Bottom 0.305: FPGA.33 95.76,28.19
DIO34  (3 unrouted)
DIO35  (1 unrouted)
DIO36  (2 unrouted)
LAT  (1 unrouted)
LED0  (1 unrouted)
LED1  (1 unrouted)
LED2  (1 unrouted)
LED3  (1 unrouted)
MCLK
  Top 0.305: U8.P$17 36.14,33.3 XTAL.3
N$1
  Top 0.305: U7.8 21.21,18.16 22.48,19.43 R12.1
N$2  (1 unrouted)
N$3
  Top 0.305: R9.1 21.27,29.15 20.45,28.32 U6.8
N$4
  Top 0.305: U8.P$1 30.38,36.8 28.7,38.48 28.7,45.59 27.81,46.48 24.57,46.48 C10.1
  Top 0.813: C10.1 R3.2
N$6
  Top 0.305: R6.1 21.52,36.9 19.94,38.48 U5.8
N$7
  Top 0.813: R14.1 80.07,83.63 79.5,84.2 79.5,85.95 U2.1
N$8
  Top 0.813: U2.2 82.55,87.71 C5.1 82.42,87.76 R14.2 82.42,85.6 L2.1
N$9
  Top 0.813: R13.1 105.47,83.5 105.03,83.95 105.03,85.95 U1.1
N$10
  Top 0.305: R3.1 21.65,44.64 20.32,45.97 20.32,47.37 19.05,48.64 U4.8
N$11
  Top 0.305: 35.5,18.48 C32.1 34.54,18.8 34.16,18.41 34.16,15.99 | U11.6 35.47,16.13 | U11.6 U11.7 | U12.9 U12.10 26.78,17.29 28.07,16 30.34,16 U12.3 | U12.3 U12.2 | U12.3 34.16,15.99 | 34.16,15.99 35.42,15.99 U11.6
N$12
  Top 0.305: U11.1 41.5,14.77 C33.1
N$14
  Top 0.305: C11.1 25.97,38.8 28.96,35.81 31.02,35.81 U8.P$3
  Top 0.813: R6.2 C11.1
N$15  (via drill 0.5)
  Top 0.305: 13.08,47.12 13.08,47.6 U4.5 | U12.1 27.73,14.69 v27.69,14.73 | v16.13,47.12 12.83,47.12
  Top 0.965: 13.08,47.12 12.83,47.12 INA.1
  Bottom 0.305: v27.69,14.73 16.89,14.73 16.13,15.49 v16.13,47.12
N$17  (via drill 0.5, 0.6)
  Top 0.305: U12.4 28.96,16.64 v28.19,17.4 | v14.35,36.96 13.08,36.96 13.08,37.45 U5.5 | v15.11,15.75 v17.53,15.75
  Top 0.965: 13.08,36.96 INB.1
  Bottom 0.305: v14.35,36.96 15.49,35.81 15.49,16.13 v15.11,15.75 | v17.53,15.75 26.54,15.75 v28.19,17.4
N$18  (via drill 0.5)
  Top 0.305: U12.8 24.51,18.54 v25.78,18.54 | v17.02,26.04 16.26,26.8 12.88,26.8 | 12.88,26.8 U6.5 | 12.88,26.8 13.01,26.75 12.95,26.8
  Top 0.965: 13.08,26.8 12.95,26.8 12.88,26.8 INC.1
  Bottom 0.305: v17.02,26.04 17.02,19.05 17.53,18.54 v25.78,18.54
N$20
  Top 0.305: C12.1 24.57,31.05 27.81,34.29 31.02,34.29 U8.P$6
  Top 0.813: R9.2 C12.1
N$21
  Top 0.305: C13.1 26.98,23.3 28.32,24.64 28.32,32.26 29.34,33.27 31,33.27 U8.P$8
  Top 0.813: R12.2 C13.1
N$25
  Top 0.305: U7.5 13.12,16.6 13.21,16.64 | 13.08,16.64 13.21,16.64 | 13.21,16.64 U12.11
  Top 0.965: IND.1 13.08,16.64
N$26
  Top 0.305: C20.1 41.72,73.77 U9.1
N$30
  Top 0.305: 37.59,78.48 U10.12 37.53,77.79 38.1,77.22 38.1,75.95 | 36.2,75.95 38.1,75.95 | 36.2,75.95 35.69,76.45 35.69,78.48 U10.15 | 36.2,75.95 36.2,73.41 U10.3 | C21.1 42.36,80.08 U9.7 | 38.1,75.95 41.91,75.95 42.35,76.38 U9.7 | U10.6 38.16,75.88 38.1,75.95 | U9.7 U9.6
N$31
  Top 0.813: U3.1 79.32,64.69 79.88,64.14 82.11,64.14 R15.1
N$32  (1 unrouted)
N$33  (via drill 0.5)  (1 unrouted)
  Top 0.305: U10.5 37.53,74.74 v37.21,75.06
N$34  (via drill 0.5)  (1 unrouted)
  Top 0.305: U10.13 36.89,77.28 v37.21,76.96
N$35  (1 unrouted)
PDAT  (via drill 0.5)
  Top 0.305: U7.2 12.31,18.66 v11.94,18.29 | U6.2 12.31,28.82 v11.94,28.45 | U5.2 12.31,38.98 v11.94,38.61 | U4.2 12.31,49.14 v11.94,48.77
  Bottom 0.305: v11.94,18.29 v11.94,28.45 v11.94,38.61 v11.94,48.77
PLAT  (via drill 0.5)
  Top 0.305: U7.1 11.45,19.16 v11.05,19.56 | U6.1 11.57,29.32 v11.05,29.84 | U5.1 11.7,39.48 v11.05,40.13 | U4.1 11.57,49.64 v11.05,50.16
  Bottom 0.305: v11.05,50.16 v11.05,40.13 v11.05,29.84 v11.05,19.56
PWRIN  (via drill 0.8)  (5 unrouted)
  Top 0.813: U1.2 107.89,87.71 C3.1 | U3.2 79.38,68.33 C7.1 82.17,68.2 | L2.2 v87.5,85.6
  Top 1.27: C1.+ 128.46,90.81 C2.1 | L3.2 v47.88,84.2 | v84.45,65.91 84.39,65.97 R15.2 82.17,68.2 | v109.98,85.47 109.92,85.41 R13.2 107.89,85.47 107.89,87.71
SRCS  (1 unrouted)
VREF
  Top 0.305: 31.05,36.32 U8.P$2 31.77,36.3 31.81,36.26 | U8.P$10 U8.P$9 31.78,33.78 | U8.P$31 U8.P$32 | U8.P$31 32.26,37.55 | U8.P$28 33.78,36.71 33.78,36.7 32.26,36.7 | 32.26,36.7 32.26,37.53 | 32.26,37.53 U8.P$31 | 32.26,37.53 32.26,37.59 | 31.78,33.78 31.78,34.8 | 31.78,34.8 31.78,35.31 | 31.78,35.31 31.78,36.22 31.81,36.26 | 31.81,36.26 32.26,36.7 | U8.P$4 31.77,35.3 31.78,35.31 | U8.P$5 31.77,34.8 31.78,34.8 | U8.P$7 31.76,33.8 31.78,33.78

### Text on the board
tNames: +D3.3V | +A5V | Sigma Delta Daughterboard V2 | Dan Kouba/Alec Dibble | Brewer Research Group, 2012 | A5 | D3.3 | +D5V | D5